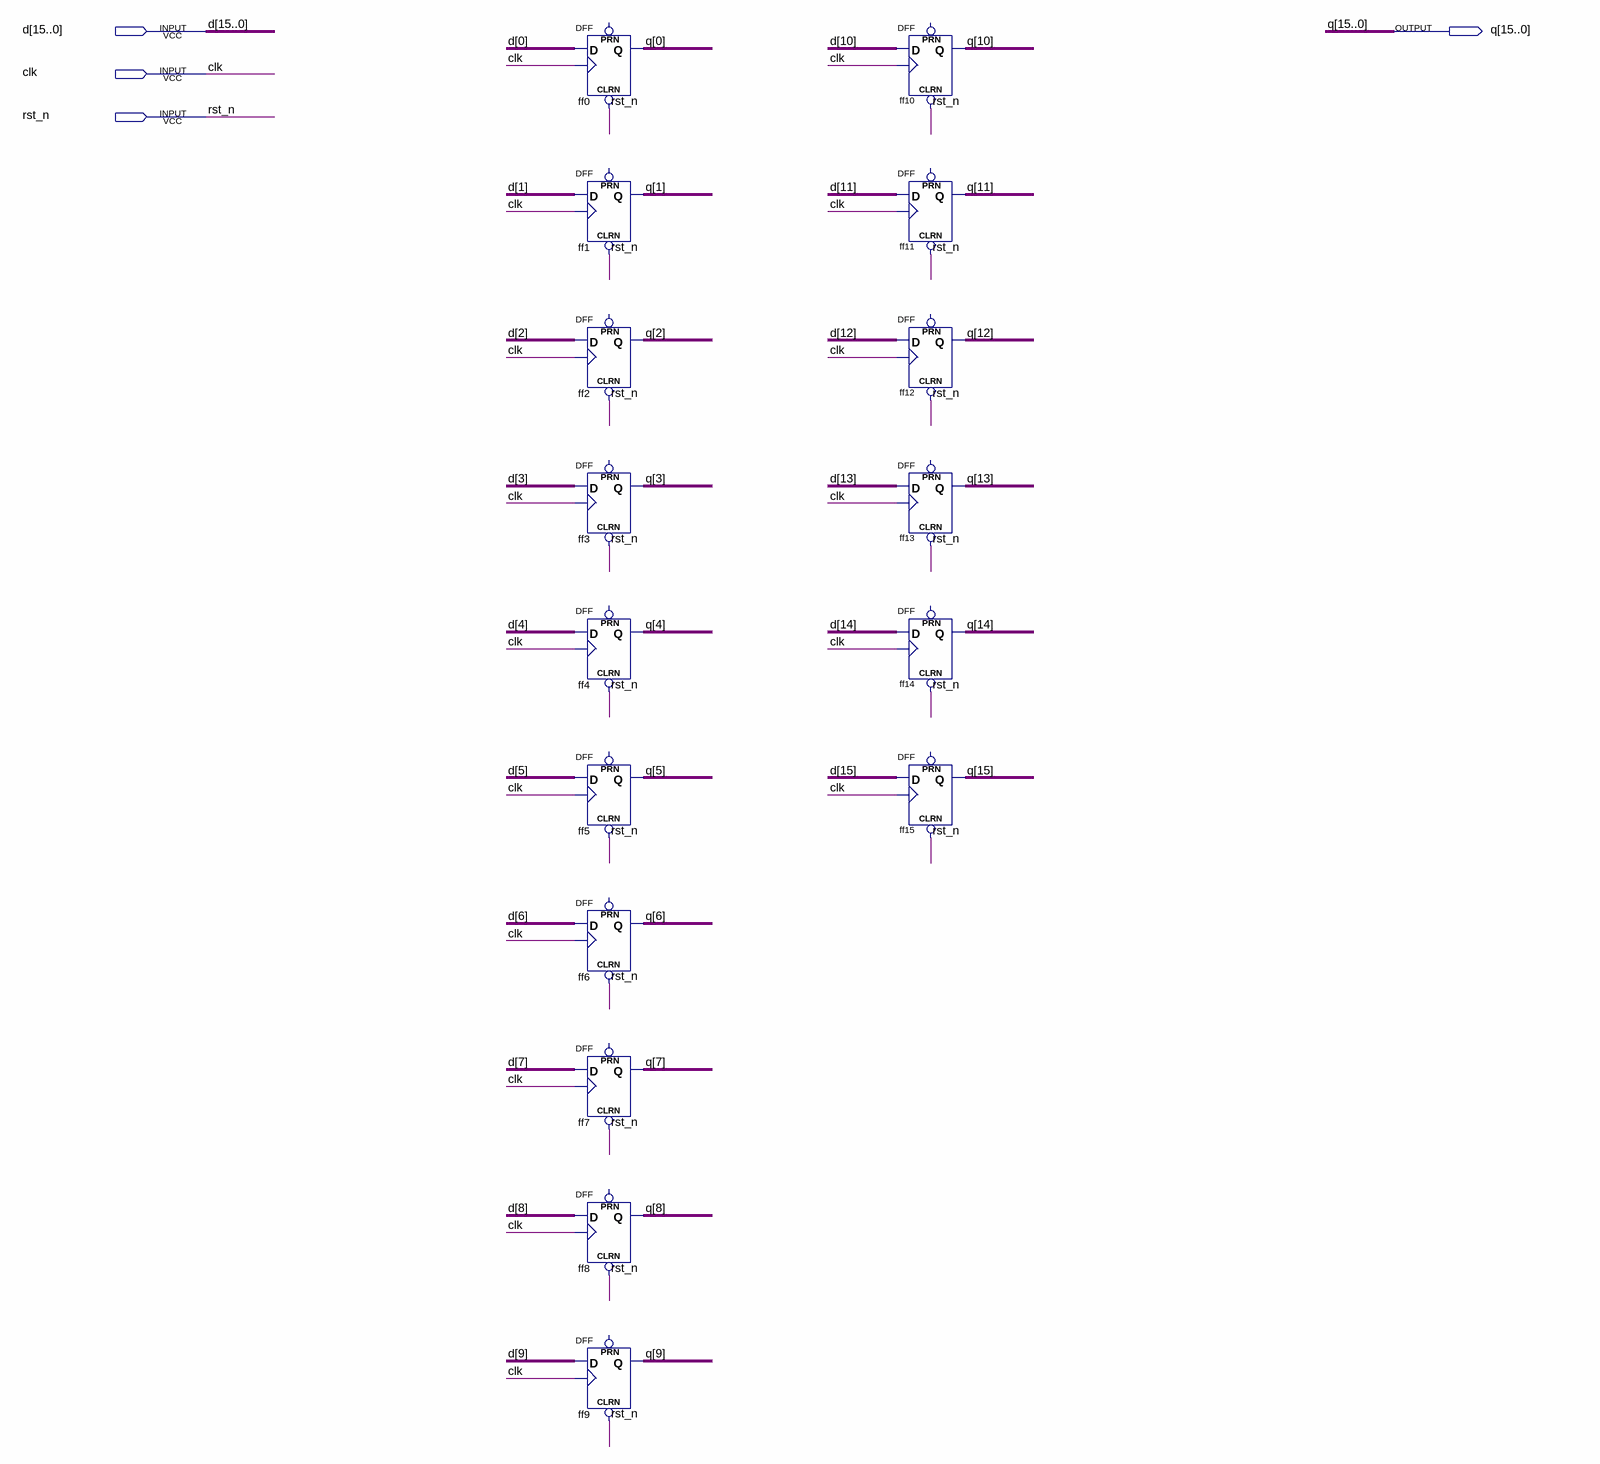
[diagram p0: schematic sheet]
// Quartus schematic reg16.bdf as structural Verilog: 16 symbols, 4 pins
module reg16 (
  input  [15:0] d,
  input  clk,
  input  rst_n,
  output [15:0] q
);

  DFF ff0 (.CLRN(rst_n), .CLK(clk), .D(d[0]), .Q(q[0]));  // open: PRN
  DFF ff1 (.CLRN(rst_n), .CLK(clk), .D(d[1]), .Q(q[1]));  // open: PRN
  DFF ff2 (.CLRN(rst_n), .CLK(clk), .D(d[2]), .Q(q[2]));  // open: PRN
  DFF ff3 (.CLRN(rst_n), .CLK(clk), .D(d[3]), .Q(q[3]));  // open: PRN
  DFF ff4 (.CLRN(rst_n), .CLK(clk), .D(d[4]), .Q(q[4]));  // open: PRN
  DFF ff5 (.CLRN(rst_n), .CLK(clk), .D(d[5]), .Q(q[5]));  // open: PRN
  DFF ff6 (.CLRN(rst_n), .CLK(clk), .D(d[6]), .Q(q[6]));  // open: PRN
  DFF ff7 (.CLRN(rst_n), .CLK(clk), .D(d[7]), .Q(q[7]));  // open: PRN
  DFF ff8 (.CLRN(rst_n), .CLK(clk), .D(d[8]), .Q(q[8]));  // open: PRN
  DFF ff9 (.CLRN(rst_n), .CLK(clk), .D(d[9]), .Q(q[9]));  // open: PRN
  DFF ff10 (.CLRN(rst_n), .CLK(clk), .D(d[10]), .Q(q[10]));  // open: PRN
  DFF ff11 (.CLRN(rst_n), .CLK(clk), .D(d[11]), .Q(q[11]));  // open: PRN
  DFF ff12 (.CLRN(rst_n), .CLK(clk), .D(d[12]), .Q(q[12]));  // open: PRN
  DFF ff13 (.CLRN(rst_n), .CLK(clk), .D(d[13]), .Q(q[13]));  // open: PRN
  DFF ff14 (.CLRN(rst_n), .CLK(clk), .D(d[14]), .Q(q[14]));  // open: PRN
  DFF ff15 (.CLRN(rst_n), .CLK(clk), .D(d[15]), .Q(q[15]));  // open: PRN
endmodule
